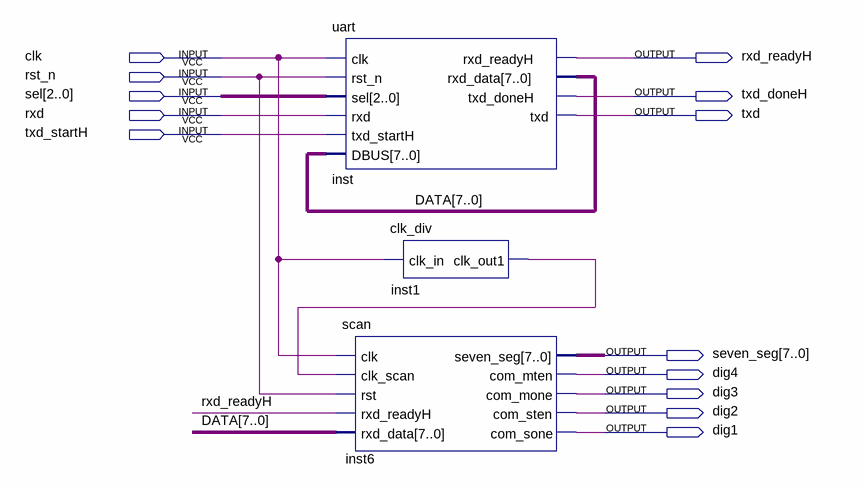
[diagram p0: schematic sheet]
// Quartus schematic uart_test.bdf as structural Verilog: 3 symbols, 13 pins
module uart_test (
  input  clk,
  input  rst_n,
  input  [2:0] sel,
  input  rxd,
  input  txd_startH,
  output rxd_readyH,
  output txd_doneH,
  output txd,
  output [7:0] seven_seg,
  output dig4,
  output dig3,
  output dig2,
  output dig1
);

  wire inst1_clk_out1;
  wire [7:0] DATA;

  uart inst (
    .clk(clk), .rst_n(rst_n), .sel(sel), .rxd(rxd), .txd_startH(txd_startH), .DBUS(DATA),
    .rxd_readyH(rxd_readyH), .rxd_data(DATA), .txd_doneH(txd_doneH), .txd(txd));
  scan inst6 (
    .clk(clk), .clk_scan(inst1_clk_out1), .rst(rst_n), .rxd_readyH(rxd_readyH), .rxd_data(DATA),
    .seven_seg(seven_seg), .com_mten(dig4), .com_mone(dig3), .com_sten(dig2), .com_sone(dig1));
  clk_div inst1 (.clk_in(clk), .clk_out1(inst1_clk_out1));
endmodule
